# Altium schematic sheet Ring 1.SchDoc
size A; DocumentNumber: 7; SheetNumber: 9; SheetTotal: 30
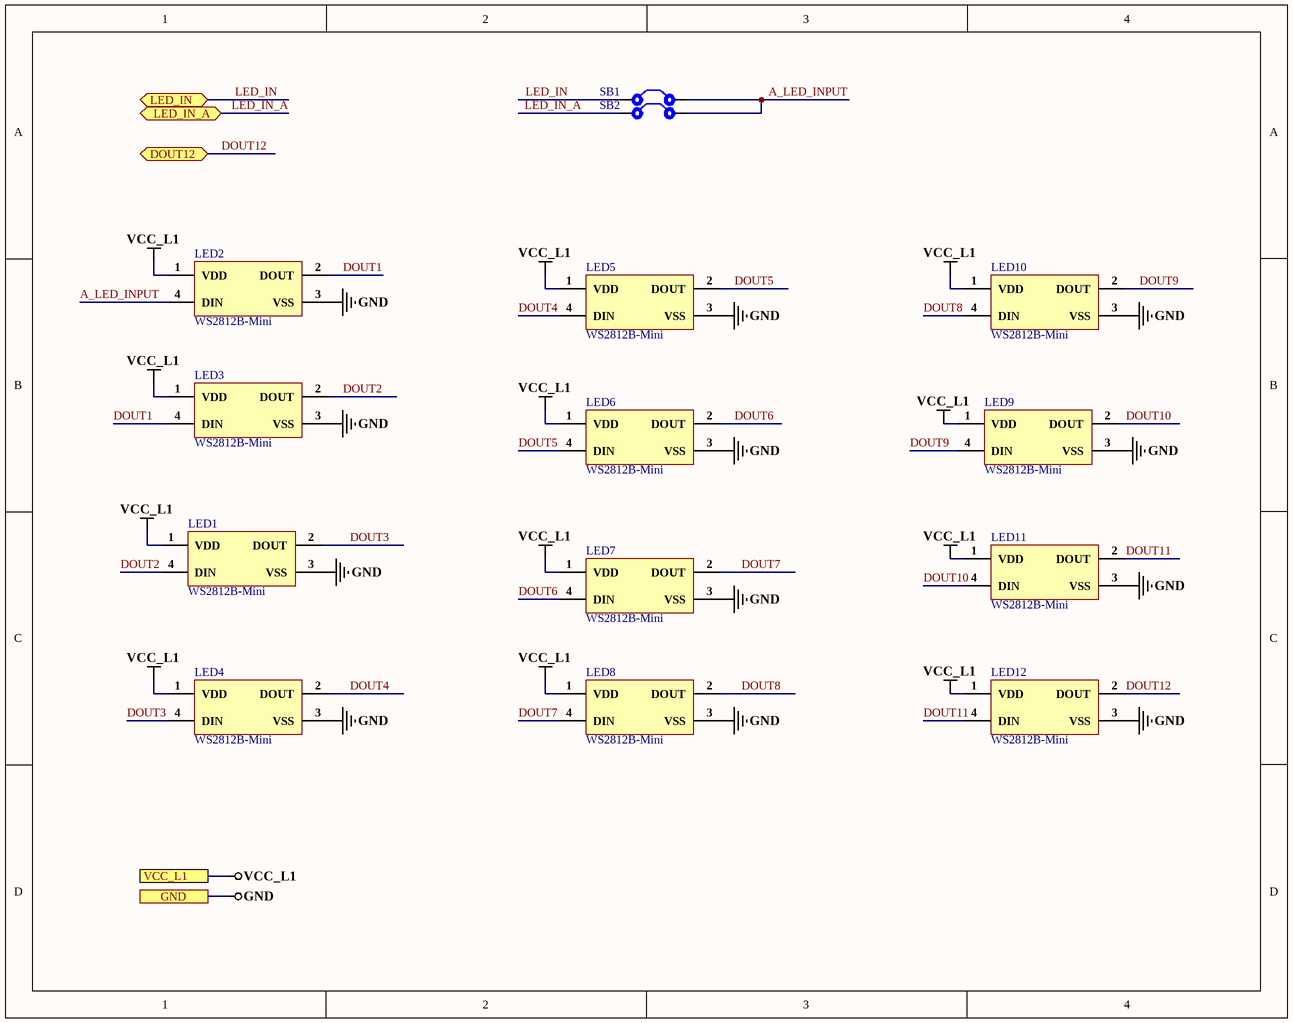
[diagram p0: Ring 1.SchDoc]

## Parts
LED1  WS2812B-Mini  [WS2812B-Mini]
LED2  WS2812B-Mini  [WS2812B-Mini]
LED3  WS2812B-Mini  [WS2812B-Mini]
LED4  WS2812B-Mini  [WS2812B-Mini]
LED5  WS2812B-Mini  [WS2812B-Mini]
LED6  WS2812B-Mini  [WS2812B-Mini]
LED7  WS2812B-Mini  [WS2812B-Mini]
LED8  WS2812B-Mini  [WS2812B-Mini]
LED9  WS2812B-Mini  [WS2812B-Mini]
LED10  WS2812B-Mini  [WS2812B-Mini]
LED11  WS2812B-Mini  [WS2812B-Mini]
LED12  WS2812B-Mini  [WS2812B-Mini]
SB1  Solder Bridge  [Solder Bridge]  (value not drawn)
SB2  Solder Bridge  [Solder Bridge]  (value not drawn)

## Ports
DOUT12 (bidir), GND, LED_IN (bidir), LED_IN_A (bidir), VCC_L1

## Nets
GND: LED1.3(VSS) LED2.3(VSS) LED3.3(VSS) LED4.3(VSS) LED5.3(VSS) LED6.3(VSS) LED7.3(VSS) LED8.3(VSS) LED9.3(VSS) LED10.3(VSS) LED11.3(VSS) LED12.3(VSS) ; port GND
VCC_L1: LED1.1(VDD) LED2.1(VDD) LED3.1(VDD) LED4.1(VDD) LED5.1(VDD) LED6.1(VDD) LED7.1(VDD) LED8.1(VDD) LED9.1(VDD) LED10.1(VDD) LED11.1(VDD) LED12.1(VDD) ; port VCC_L1
A_LED_INPUT: LED2.4(DIN) SB1.2 SB2.2
DOUT1: LED2.2(DOUT) LED3.4(DIN)
DOUT2: LED1.4(DIN) LED3.2(DOUT)
DOUT3: LED1.2(DOUT) LED4.4(DIN)
DOUT4: LED4.2(DOUT) LED5.4(DIN)
DOUT5: LED5.2(DOUT) LED6.4(DIN)
DOUT6: LED6.2(DOUT) LED7.4(DIN)
DOUT7: LED7.2(DOUT) LED8.4(DIN)
DOUT8: LED8.2(DOUT) LED10.4(DIN)
DOUT9: LED9.4(DIN) LED10.2(DOUT)
DOUT10: LED9.2(DOUT) LED11.4(DIN)
DOUT11: LED11.2(DOUT) LED12.4(DIN)
DOUT12: LED12.2(DOUT) ; port DOUT12
LED_IN: SB1.1 ; port LED_IN
LED_IN_A: SB2.1 ; port LED_IN_A

## Library data of the parts
LED1-LED12 = WS2812B-Mini: SMD,3.5x3.5mm Light Emitting Diodes (LED) RoHS; Manufacturer: Worldsemi; ComponentLink1Description: LCSC; ComponentLink1URL: *https://lcsc.com/product-detail/Light-Emitting-Diodes-LED_Worldsemi-WS2812B-Mini_C527089.html; Package: SMD,3.5x3.5mm; Parameter 1: *
SB1 SB2 = Solder Bridge: Solder Bridge ON